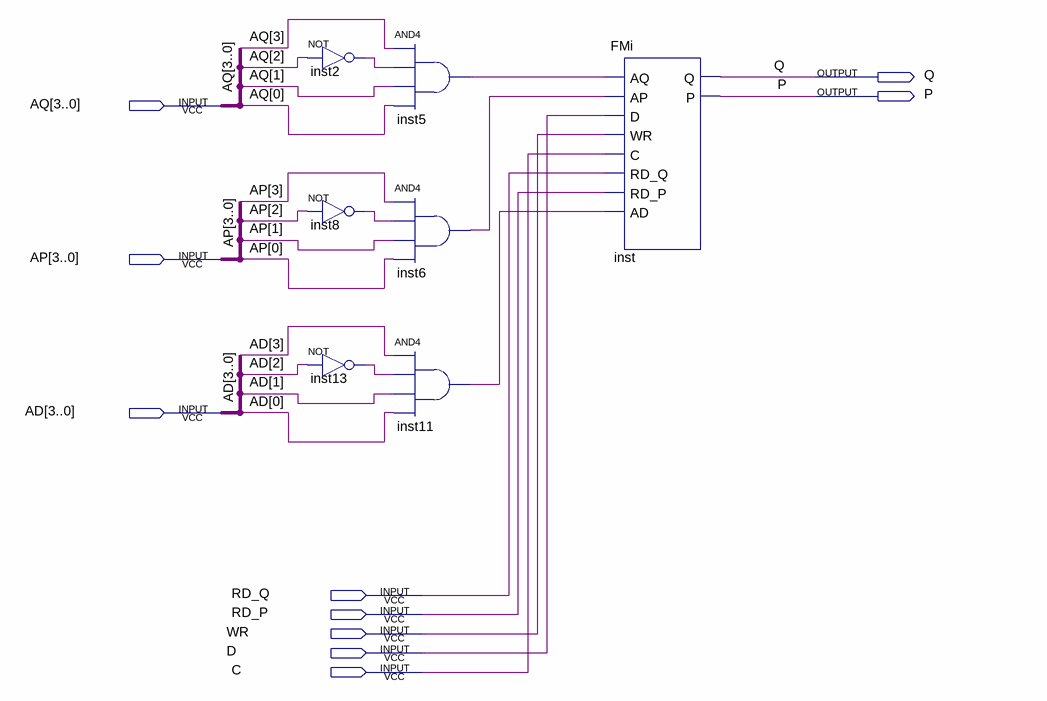
[diagram p0: schematic sheet]
// Quartus schematic FM1011.bdf as structural Verilog: 7 symbols, 10 pins
module FM1011 (
  input  [3:0] AQ,
  input  [3:0] AP,
  input  [3:0] AD,
  input  RD_Q,
  input  RD_P,
  input  WR,
  input  D,
  input  C,
  output Q,
  output P
);

  wire inst2_out, inst5_out, inst6_out, inst8_out, inst11_out, inst13_out;

  not inst2 (inst2_out, AQ[2]);
  not inst8 (inst8_out, AP[2]);
  not inst13 (inst13_out, AD[2]);
  and inst5 (inst5_out, AQ[3], inst2_out, AQ[1], AQ[0]);
  and inst6 (inst6_out, AP[3], inst8_out, AP[1], AP[0]);
  and inst11 (inst11_out, AD[3], inst13_out, AD[1], AD[0]);
  FMi inst (
    .AQ(inst5_out), .AP(inst6_out), .D(D), .WR(WR), .C(C), .RD_Q(RD_Q), .RD_P(RD_P), .AD(inst11_out), .Q(Q),
    .P(P));
endmodule
